# EAGLE design carte (EAGLE 9.6.2)
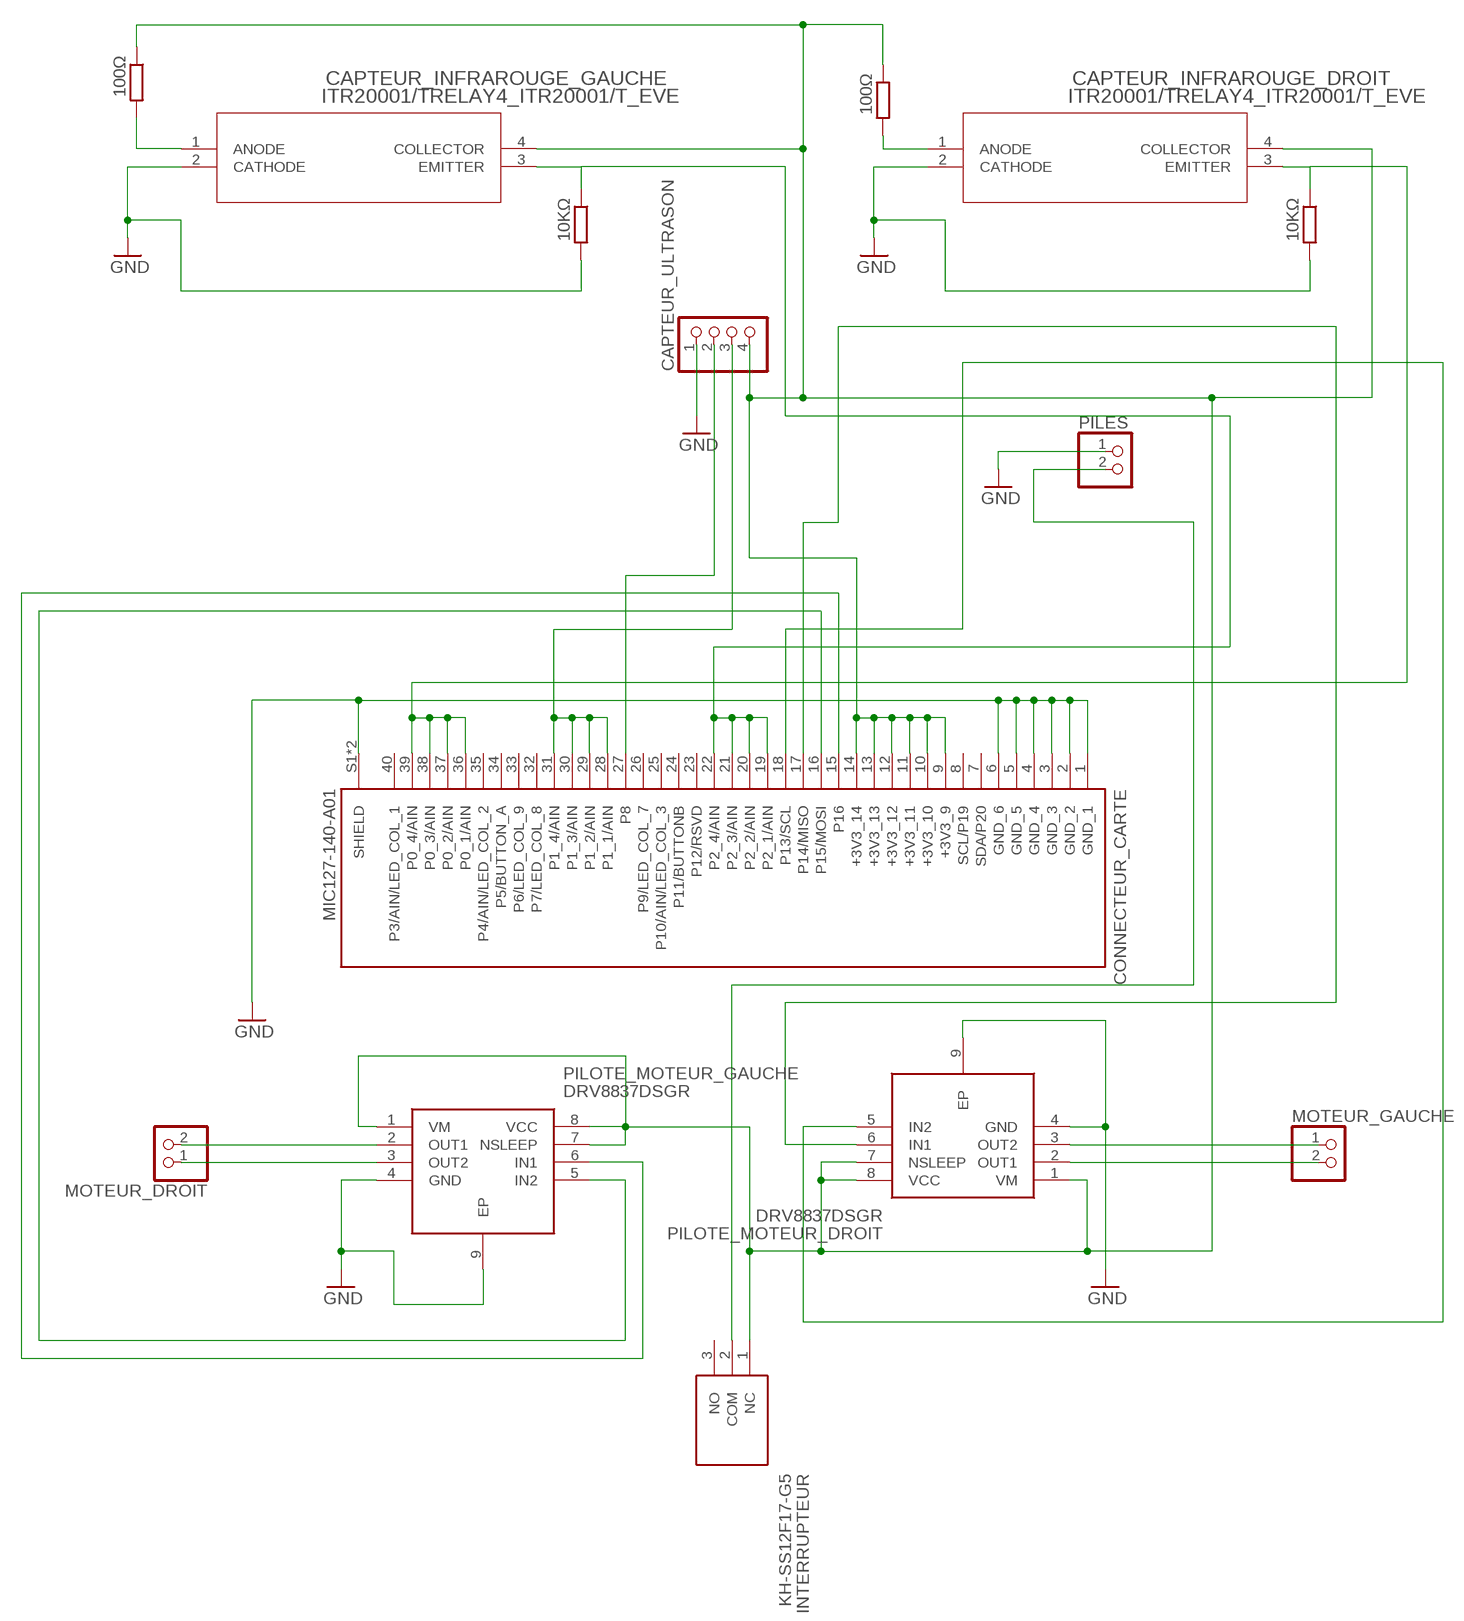
[diagram p0: schematic, sheet 1]

## Parts
CAPTEUR_INFRAROUGE_DROIT  ITR20001/TRELAY4_ITR20001/T_EVE  [RELAY4_ITR20001/T_EVE]
CAPTEUR_INFRAROUGE_GAUCHE  ITR20001/TRELAY4_ITR20001/T_EVE  [RELAY4_ITR20001/T_EVE]
CAPTEUR_ULTRASON  PINHD-1X4  [1X04]
CONNECTEUR_CARTE  MIC127-140-A01  [DONGGUAN_MIC127-140-A01]
INTERRUPTEUR  KH-SS12F17-G5  [KHSS12F17G5]
MOTEUR_DROIT  PINHD-1X2  [1X02]
MOTEUR_GAUCHE  PINHD-1X2  [1X02]
PILES  PINHD-1X2  [1X02]
PILOTE_MOTEUR_DROIT  DRV8837DSGR  [SON50P200X200X80-9N]
PILOTE_MOTEUR_GAUCHE  DRV8837DSGR  [SON50P200X200X80-9N]
R1  10KΩ  R-EU_R0603  [R0603]
R2  100Ω  R-EU_R0603  [R0603]
R3  10KΩ  R-EU_R0603  [R0603]
R5  100Ω  R-EU_R0603  [R0603]

## Nets
3V: CAPTEUR_INFRAROUGE_DROIT.4(COLLECTOR) CAPTEUR_INFRAROUGE_GAUCHE.4(COLLECTOR) CAPTEUR_ULTRASON.4 CONNECTEUR_CARTE.9(+3V3_9) CONNECTEUR_CARTE.10(+3V3_10) CONNECTEUR_CARTE.11(+3V3_11) CONNECTEUR_CARTE.12(+3V3_12) CONNECTEUR_CARTE.13(+3V3_13) CONNECTEUR_CARTE.14(+3V3_14) INTERRUPTEUR.1(NC) PILOTE_MOTEUR_DROIT.1(VM) PILOTE_MOTEUR_DROIT.7(NSLEEP) PILOTE_MOTEUR_DROIT.8(VCC) PILOTE_MOTEUR_GAUCHE.1(VM) PILOTE_MOTEUR_GAUCHE.7(NSLEEP) PILOTE_MOTEUR_GAUCHE.8(VCC) R2.1 R5.1
GND: CAPTEUR_INFRAROUGE_DROIT.2(CATHODE) CAPTEUR_INFRAROUGE_GAUCHE.2(CATHODE) CAPTEUR_ULTRASON.1 CONNECTEUR_CARTE.1(GND_1) CONNECTEUR_CARTE.2(GND_2) CONNECTEUR_CARTE.3(GND_3) CONNECTEUR_CARTE.4(GND_4) CONNECTEUR_CARTE.5(GND_5) CONNECTEUR_CARTE.6(GND_6) CONNECTEUR_CARTE.S1(SHIELD) CONNECTEUR_CARTE.S2(SHIELD) PILES.1 PILOTE_MOTEUR_DROIT.4(GND) PILOTE_MOTEUR_DROIT.9(EP) PILOTE_MOTEUR_GAUCHE.4(GND) PILOTE_MOTEUR_GAUCHE.9(EP) R1.2 R3.2
N$1: MOTEUR_DROIT.2 PILOTE_MOTEUR_GAUCHE.2(OUT1)
N$2: MOTEUR_DROIT.1 PILOTE_MOTEUR_GAUCHE.3(OUT2)
N$3: MOTEUR_GAUCHE.1 PILOTE_MOTEUR_DROIT.3(OUT2)
N$4: MOTEUR_GAUCHE.2 PILOTE_MOTEUR_DROIT.2(OUT1)
N$6: CAPTEUR_INFRAROUGE_GAUCHE.1(ANODE) R5.2
N$9: INTERRUPTEUR.2(COM) PILES.2
N$11: CAPTEUR_INFRAROUGE_DROIT.1(ANODE) R2.2
P0: CAPTEUR_INFRAROUGE_DROIT.3(EMITTER) CONNECTEUR_CARTE.36(P0_1/AIN) CONNECTEUR_CARTE.37(P0_2/AIN) CONNECTEUR_CARTE.38(P0_3/AIN) CONNECTEUR_CARTE.39(P0_4/AIN) R3.1
P1: CAPTEUR_ULTRASON.3 CONNECTEUR_CARTE.28(P1_1/AIN) CONNECTEUR_CARTE.29(P1_2/AIN) CONNECTEUR_CARTE.30(P1_3/AIN) CONNECTEUR_CARTE.31(P1_4/AIN)
P2: CAPTEUR_INFRAROUGE_GAUCHE.3(EMITTER) CONNECTEUR_CARTE.19(P2_1/AIN) CONNECTEUR_CARTE.20(P2_2/AIN) CONNECTEUR_CARTE.21(P2_3/AIN) CONNECTEUR_CARTE.22(P2_4/AIN) R1.1
P8: CAPTEUR_ULTRASON.2 CONNECTEUR_CARTE.27(P8)
P13: CONNECTEUR_CARTE.18(P13/SCL) PILOTE_MOTEUR_DROIT.5(IN2)
P14: CONNECTEUR_CARTE.17(P14/MISO) PILOTE_MOTEUR_DROIT.6(IN1)
P15: CONNECTEUR_CARTE.16(P15/MOSI) PILOTE_MOTEUR_GAUCHE.5(IN2)
P16: CONNECTEUR_CARTE.15(P16) PILOTE_MOTEUR_GAUCHE.6(IN1)
Unconnected: CONNECTEUR_CARTE.7(SDA/P20) CONNECTEUR_CARTE.8(SCL/P19) CONNECTEUR_CARTE.23(P12/RSVD) CONNECTEUR_CARTE.24(P11/BUTTONB) CONNECTEUR_CARTE.25(P10/AIN/LED_COL_3) CONNECTEUR_CARTE.26(P9/LED_COL_7) CONNECTEUR_CARTE.32(P7/LED_COL_8) CONNECTEUR_CARTE.33(P6/LED_COL_9) CONNECTEUR_CARTE.34(P5/BUTTON_A) CONNECTEUR_CARTE.35(P4/AIN/LED_COL_2) CONNECTEUR_CARTE.40(P3/AIN/LED_COL_1) INTERRUPTEUR.3(NO)

## Library data of the parts
CAPTEUR_INFRAROUGE_DROIT CAPTEUR_INFRAROUGE_GAUCHE = ITR20001:T:ITR20001/T: Check availability <https://pricing.snapeda.com/parts/ITR20001/T/Everlight%20Electronics/view-part?ref=eda>; AVAILABILITY: In Stock; CHECK_PRICES: https://www.snapeda.com/parts/ITR20001/T/Everlight/view-part/?ref=eda; DESCRIPTION: Reflective Optical Sensor 0.197 (5mm) 4-DIP (0.100, 2.54mm); LCSC: C264269; MF: Everlight Electronics; MP: ITR20001/T; PACKAGE: DIP-4 Everlight; PRICE: None; SNAPEDA_LINK: https://www.snapeda.com/parts/ITR20001/T/Everlight/view-part/?ref=snap
CAPTEUR_ULTRASON = pinhead:PINHD-1X4: PIN HEADER
CONNECTEUR_CARTE = MIC127-140-A01:MIC127-140-A01: Check availability <https://pricing.snapeda.com/parts/MIC127-140-A01/Dongguan%20Liyang%20electronics/view-part?ref=eda>; AVAILABILITY: Not in stock; CHECK_PRICES: https://www.snapeda.com/parts/MIC127-140-A01/Dongguan+Liyang+electronics/view-part/?ref=eda; DESCRIPTION: 40-pins Micro Bit-connector, SMT; LCSC: C5154027; MF: Dongguan Liyang electronics; MP: MIC127-140-A01; PACKAGE: Package; PRICE: None; SNAPEDA_LINK: https://www.snapeda.com/parts/MIC127-140-A01/Dongguan+Liyang+electronics/view-part/?ref=snap
INTERRUPTEUR = KH-SS12F17-G5:KH-SS12F17-G5: Plugin Slide Switches ROHS Source: Datasheet <https://www.kinghelm.net/slide-switch/501830.html>; DESCRIPTION: Plugin Slide Switches ROHS; HEIGHT: 8.7mm; LCSC: C5274464; MANUFACTURER_NAME: Shenzhen Kinghelm Elec; MANUFACTURER_PART_NUMBER: KH-SS12F17-G5
MOTEUR_DROIT MOTEUR_GAUCHE PILES = pinhead:PINHD-1X2: PIN HEADER
PILOTE_MOTEUR_DROIT PILOTE_MOTEUR_GAUCHE = DRV8837DSGR:DRV8837DSGR: 1.8A Low Voltage Brushed DC Motor Driver (PWM Ctrl) Source: Datasheet <http://www.ti.com/lit/gpn/drv8837>; ARROW_PART_NUMBER: DRV8837DSGR; ARROW_PRICE-STOCK: https://www.arrow.com/en/products/drv8837dsgr/texas-instruments?utm_currency=USD&region=nac; DESCRIPTION: 1.8A Low Voltage Brushed DC Motor Driver (PWM Ctrl); HEIGHT: 0.8mm; LCSC: C39159; MANUFACTURER_NAME: Texas Instruments; MANUFACTURER_PART_NUMBER: DRV8837DSGR; MOUSER_PART_NUMBER: 595-DRV8837DSGR; MOUSER_PRICE-STOCK: https://www.mouser.co.uk/ProductDetail/Texas-Instruments/DRV8837DSGR?qs=l6ZoeTYLMwO0pKIJ8222Ww%3D%3D
R1 R3 = rcl:R-EU_: RESISTOR, European symbol; LCSC: C25804; SPICEPREFIX: R
R2 R5 = rcl:R-EU_: RESISTOR, European symbol; LCSC: C22775; SPICEPREFIX: R

## Board
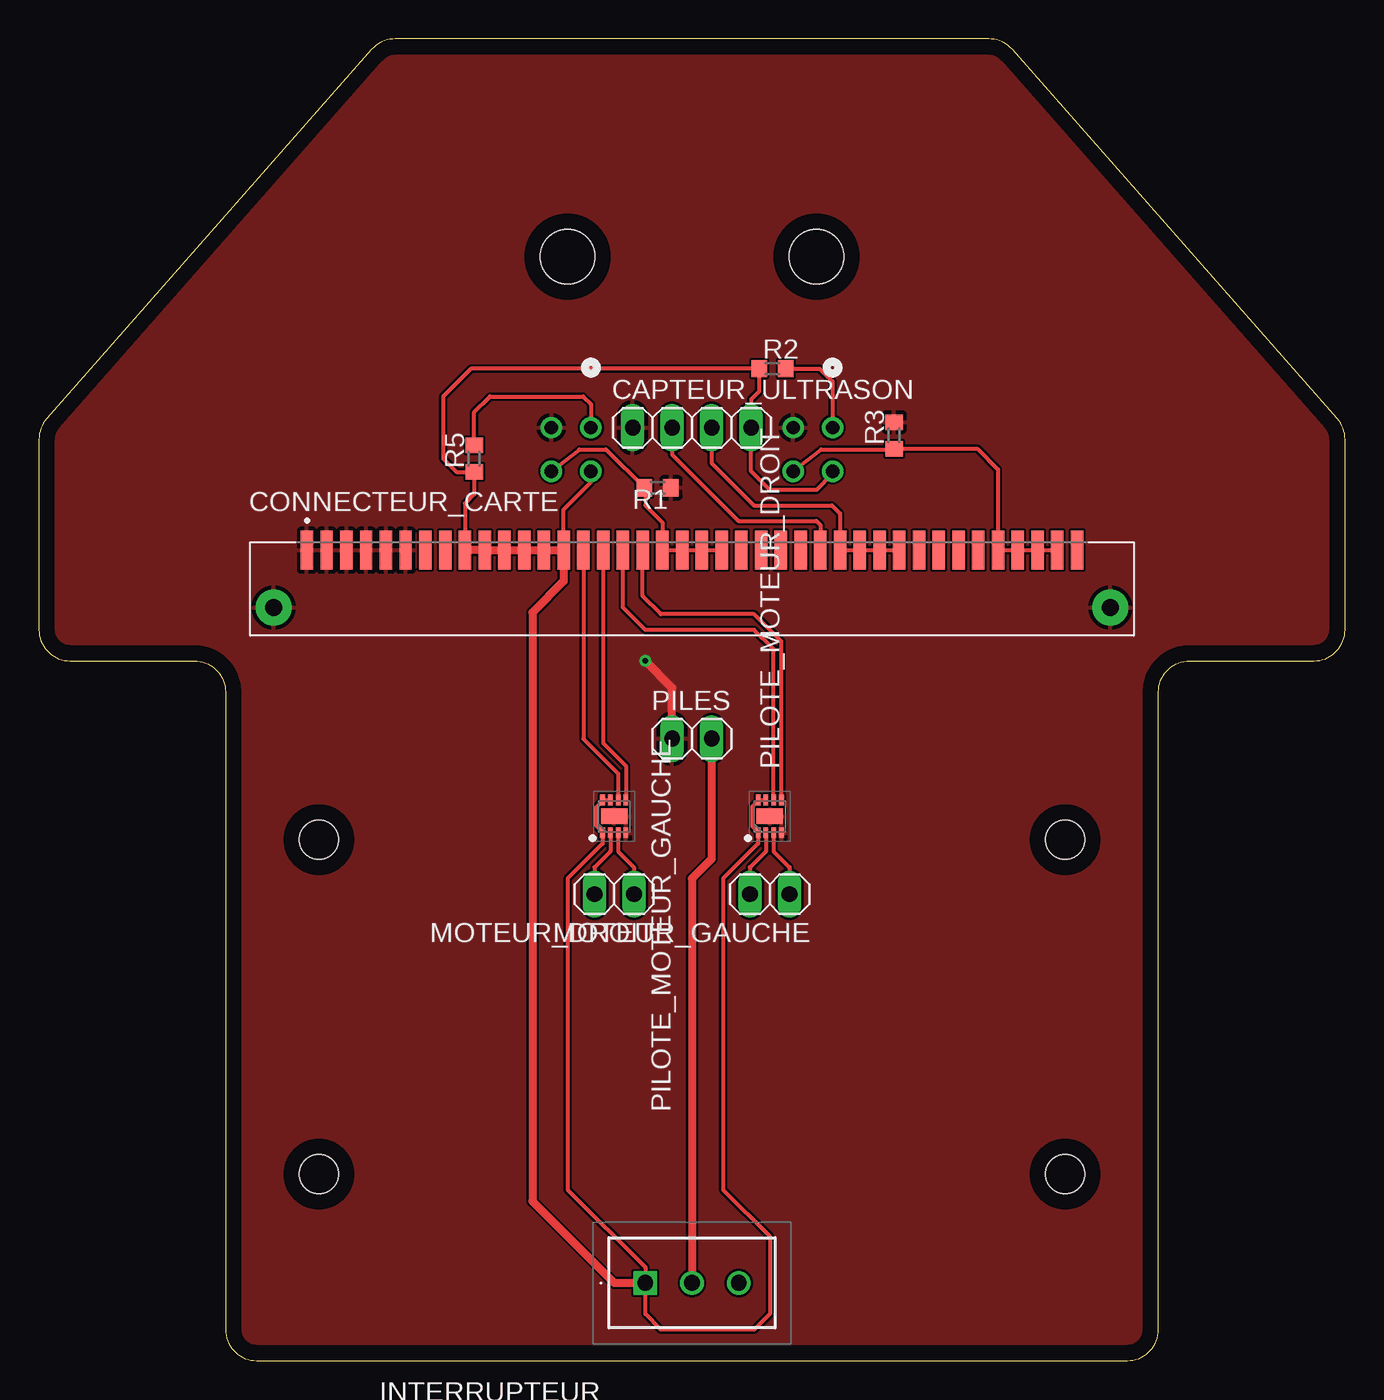
[diagram p1: board, top side]
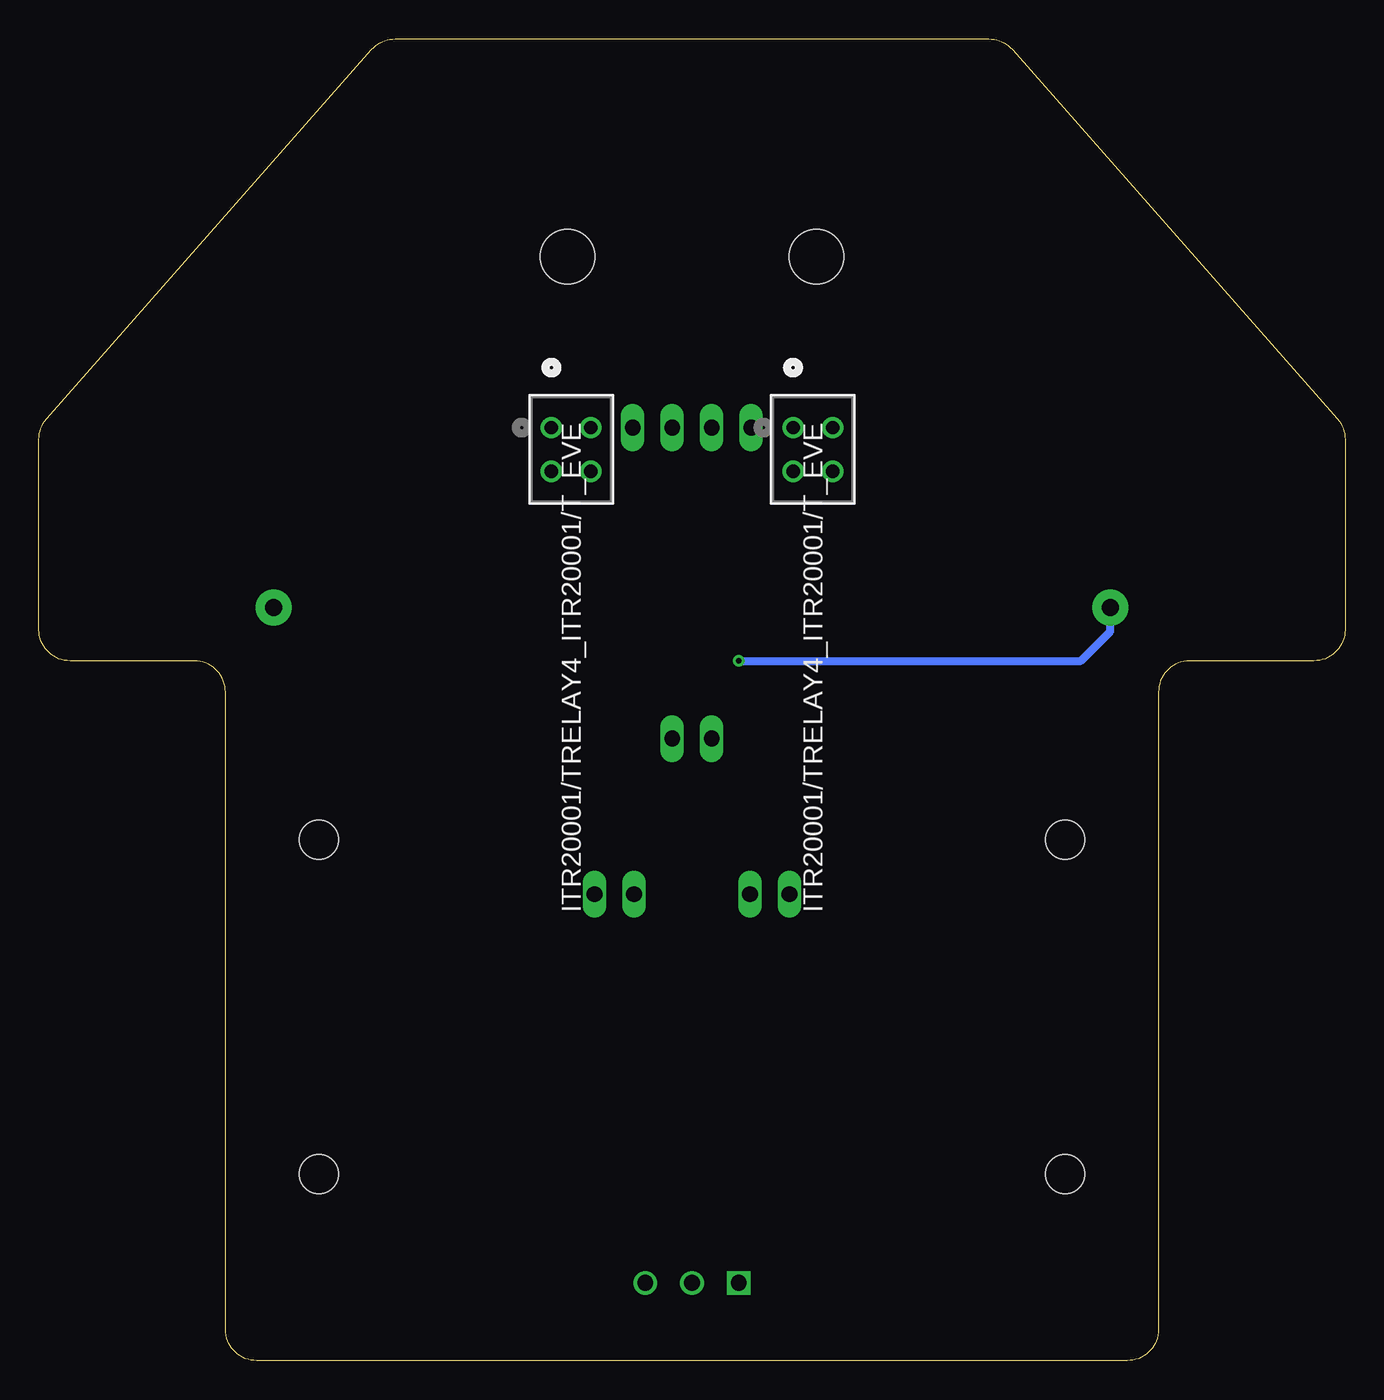
[diagram p2: board, bottom side, seen from below]

Size 84 x 85 mm. Coordinates in mm from the lower left corner, seen from the top.
Outline: 83.5,60.57 62.6,84.32 arc49 61.1,85 22.9,85 arc49 21.4,84.32 0.5,60.57 arc41 0,59.24 0,47 arc90 2,45 10,45 arc-90 12,43 12,2 arc90 14,0 70,0 arc90 72,2 72,43 arc-90 74,45 82,45 arc90 84,47 84,59.24 arc41 83.5,60.57
Copper layers (1*16): Top 0.035mm / dielectric 1.5mm / Bottom 0.035mm
Design rules "default": minimum track width 6mil, minimum drill 0.35mm, track to track 6mil, track to pad 6mil, pad to pad 6mil, via to via 6mil, smd to smd 6mil, copper to edge 40mil, drill to drill 6mil, minimum pad ring 10mil, minimum via ring 8mil, stop-mask expansion 4mil, vias tented up to drill 0mil, thermal gap 10mil
Holes 3.5 mm at 34,71 50,71
Holes 2.5 mm at 18,33.5 18,12 66,33.5 66,12

### Footprints (pad centres in the part's own frame; a part is rotated, then mirrored left to right if it is on the bottom)
RELAY4_ITR20001/T_EVE = drill 0.864 pad 1.372: 1 0,0; 2 0,2.54; 3 2.8,2.54; 4 2.8,0
1X04 = drill 1.016 long: 1 -3.81,0; 2 -1.27,0; 3 1.27,0; 4 3.81,0
DONGGUAN_MIC127-140-A01 = smd 0.8 x 2.5: 1 -24.765,2.12; 2 -23.495,2.12; 3 -22.225,2.12; 4 -20.955,2.12; 5 -19.685,2.12; 6 -18.415,2.12; 7 -17.145,2.12; 8 -15.875,2.12; 9 -14.605,2.12; 10 -13.335,2.12; 11 -12.065,2.12; 12 -10.795,2.12; 13 -9.525,2.12; 14 -8.255,2.12; 15 -6.985,2.12; 16 -5.715,2.12; 17 -4.445,2.12; 18 -3.175,2.12; 19 -1.905,2.12; 20 -0.635,2.12; 21 0.635,2.12; 22 1.905,2.12; 23 3.175,2.12; 24 4.445,2.12; 25 5.715,2.12; 26 6.985,2.12; 27 8.255,2.12; 28 9.525,2.12; 29 10.795,2.12; 30 12.065,2.12; 31 13.335,2.12; 32 14.605,2.12; 33 15.875,2.12; 34 17.145,2.12; 35 18.415,2.12; 36 19.685,2.12; 37 20.955,2.12; 38 22.225,2.12; 39 23.495,2.12; 40 24.765,2.12 | drill 1.1 pad 2.3: S1 -26.9,-1.57; S2 26.9,-1.57
KHSS12F17G5 = drill 1.01 pad 1.515 square: 1 0,0 | drill 1.01 pad 1.515: 2 3,0; 3 6,0
1X02 = drill 1.016 long: 1 -1.27,0; 2 1.27,0
SON50P200X200X80-9N = smd 0.7 x 0.3: 1 -1.05,0.75; 2 -1.05,0.25; 3 -1.05,-0.25; 4 -1.05,-0.75; 5 1.05,-0.75; 6 1.05,-0.25; 7 1.05,0.25; 8 1.05,0.75 | smd 1 x 1.7: 9 0,0
R0603 = smd 1 x 1.1: 1 -0.85,0; 2 0.85,0

### Placement (x,y rotation side)
CAPTEUR_INFRAROUGE_DROIT  51.04,60 270 bottom
CAPTEUR_INFRAROUGE_GAUCHE  35.5,60 270 bottom
CAPTEUR_ULTRASON  42,60 0 top
CONNECTEUR_CARTE  42,50 0 top
INTERRUPTEUR  39,5 0 top
MOTEUR_DROIT  37,30 180 top
MOTEUR_GAUCHE  47,30 180 top
PILES  42,40 0 top
PILOTE_MOTEUR_DROIT  47,35 90 top
PILOTE_MOTEUR_GAUCHE  37,35 90 top
R1  39.79,56.13 0 top
R2  47.17,63.79 0 top
R3  55,59.5 90 top
R5  28,58 90 top

### Tracks (layer width: path | path; a pad name or v marks a point on that pad's centre or on a via)
3V
  Top 0.254: PILOTE_MOTEUR_DROIT.7 PILOTE_MOTEUR_DROIT.8 46.25,35.99 45.87,35.62 45.87,34.38 46.25,34.01 PILOTE_MOTEUR_DROIT.1 46.25,33.25 44,31 44,11 47,8 47,3 46,2 40,2 39,3 INTERRUPTEUR.1 39,6 34,11 34,31 36.25,33.25 PILOTE_MOTEUR_GAUCHE.1 36.25,34.01 35.87,34.38 35.87,35.62 36.25,35.99 PILOTE_MOTEUR_GAUCHE.8 PILOTE_MOTEUR_GAUCHE.7 | CAPTEUR_INFRAROUGE_DROIT.4 51.04,57.04 50,56 47,56 45.81,57.19 CAPTEUR_ULTRASON.4 45.81,61.81 46.32,62.32 R2.1 27.79,63.79 26,62 26,58 26.85,57.15 R5.1 28,55.73 27.39,55.12 CONNECTEUR_CARTE.9 | CONNECTEUR_CARTE.14 33.74,54.74 35.5,56.5 CAPTEUR_INFRAROUGE_GAUCHE.4
  Top 0.508: INTERRUPTEUR.1 37,5 31.75,10.26 31.75,48.12 33.74,50.12 CONNECTEUR_CARTE.14 CONNECTEUR_CARTE.13 CONNECTEUR_CARTE.12 CONNECTEUR_CARTE.11 CONNECTEUR_CARTE.10 CONNECTEUR_CARTE.9
GND  (via drill 0.35)
  Top 0.508: PILES.1 40.73,43.27 v39,45
  Bottom 0.508: v39,45 17,45 15.1,46.9 CONNECTEUR_CARTE.S1
  pour Top: 21,88 63,88 87,61 87,12 72,-3 12,-3 -3,12 -3,61
N$1
  Top 0.254: PILOTE_MOTEUR_GAUCHE.2 36.75,32.75 35.73,31.73 MOTEUR_DROIT.2
N$2
  Top 0.254: PILOTE_MOTEUR_GAUCHE.3 37.25,32.75 38.27,31.73 MOTEUR_DROIT.1
N$3
  Top 0.254: PILOTE_MOTEUR_DROIT.3 47.25,32.75 48.27,31.73 MOTEUR_GAUCHE.1
N$4
  Top 0.254: PILOTE_MOTEUR_DROIT.2 46.75,32.75 45.73,31.73 MOTEUR_GAUCHE.2
N$6
  Top 0.254: R5.2 28,61 29,62 35,62 35.5,61.5 CAPTEUR_INFRAROUGE_GAUCHE.1
N$9
  Top 0.508: PILES.2 43.27,32.27 42,31 INTERRUPTEUR.2
N$11
  Top 0.254: R2.2 50.21,63.79 51.04,62.96 CAPTEUR_INFRAROUGE_DROIT.1
P0
  Top 0.254: CONNECTEUR_CARTE.39 CONNECTEUR_CARTE.38 CONNECTEUR_CARTE.37 CONNECTEUR_CARTE.36 61.69,57.31 60.35,58.65 R3.1 54.95,58.6 50.3,58.6 CAPTEUR_INFRAROUGE_DROIT.3
P1
  Top 0.254: CONNECTEUR_CARTE.31 CONNECTEUR_CARTE.30 CONNECTEUR_CARTE.29 CONNECTEUR_CARTE.28 51.52,54.48 51,55 46,55 43.27,57.73 CAPTEUR_ULTRASON.3
P2
  Top 0.254: CONNECTEUR_CARTE.22 CONNECTEUR_CARTE.21 CONNECTEUR_CARTE.20 CONNECTEUR_CARTE.19 40.09,53.91 39,55 39,56.07 R1.1 36.47,58.6 34.76,58.6 CAPTEUR_INFRAROUGE_GAUCHE.3
P8
  Top 0.254: CAPTEUR_ULTRASON.2 40.73,58.27 45,54 50,54 50.26,53.74 CONNECTEUR_CARTE.27
P13
  Top 0.254: CONNECTEUR_CARTE.18 38.83,49.17 40,48 46,48 47.75,46.25 PILOTE_MOTEUR_DROIT.5
P14
  Top 0.254: CONNECTEUR_CARTE.17 37.55,48.45 39,47 46,47 47.25,45.75 PILOTE_MOTEUR_DROIT.6
P15
  Top 0.254: CONNECTEUR_CARTE.16 36.28,39.72 37.75,38.25 PILOTE_MOTEUR_GAUCHE.5
P16
  Top 0.254: CONNECTEUR_CARTE.15 35.02,39.98 37.25,37.75 PILOTE_MOTEUR_GAUCHE.6

### Text on the board
tText: Micro'BOT | V1.0.0 | ON | OFF